# EasyEDA Pro project backup.epro, board PCB_Pre_1
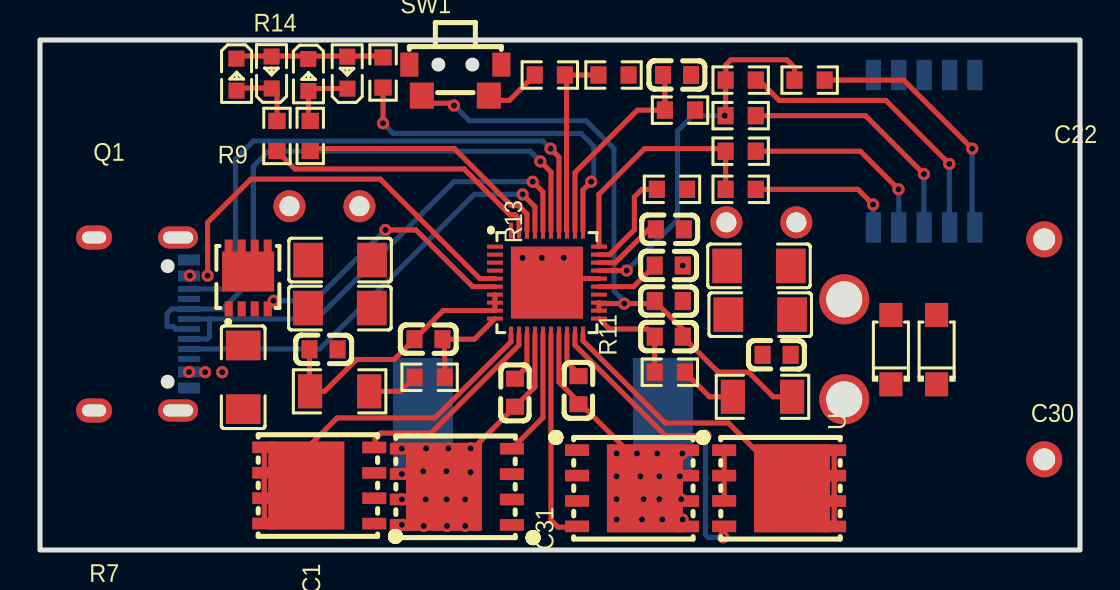
[diagram p6: board, top side]
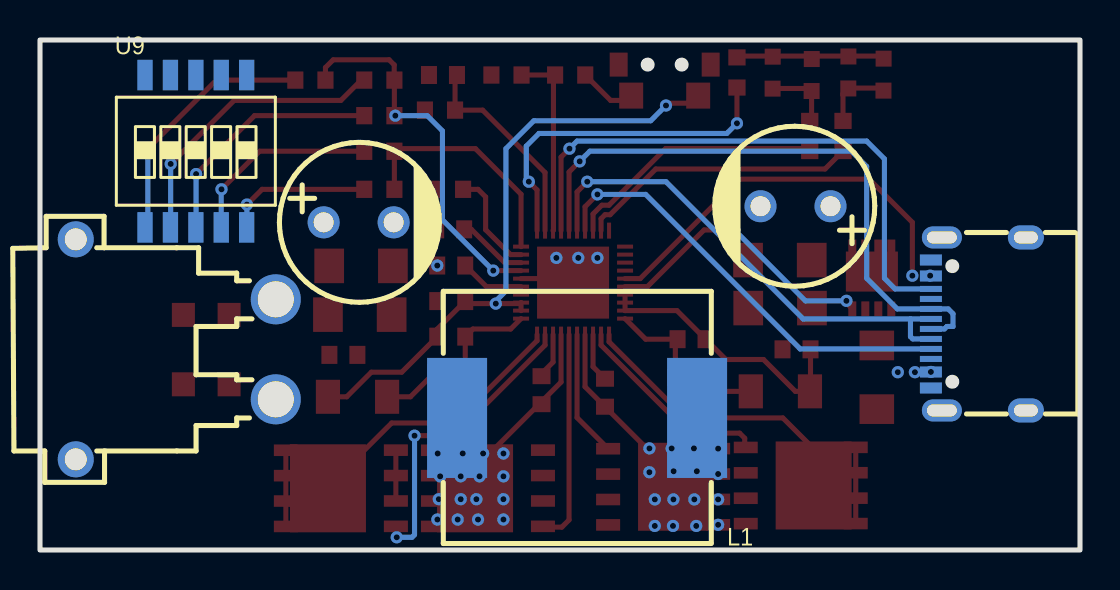
[diagram p7: board, bottom side, seen from below]

Outline 52 x 25.5 mm; copper layers: Top Layer, Inner1, Inner2, Bottom Layer. Coordinates in mm from the lower left corner of the outline.
Outline path: rectangle 0,25.5 52,0
Stack: Top Layer 0.035mm 外层铜厚1oz / Dielectric1 0.2104mm 7628 RC49% 8.6mil / Inner1 0.0152mm 内层铜厚 / Dielectric2 1.065mm 1.1mm H/HOZ 含铜 / Inner2 0.0152mm 内层铜厚 / Dielectric3 0.2104mm 7628 RC49% 8.6mil / Bottom Layer 0.035mm 外层铜厚1oz

## Design rules (mm)
template: 自定义配置
spacing copperThickness1oz (default): track to track 0.102, other pairs 0.152 to 0.3
spacing copperThickness2oz: track to track 0.203, other pairs 0.152 to 0.3
track width copperThickness1oz (default): min 0.127, default 0.254, max 2.54
track width copperThickness2oz: min 0.203, default 0.254, max 2.54
differential pair differentialPair (default): width min 0.127, default 0.254, max 2.54; gap min 0.152, default 0.152
via viaSize (default): diameter min 0.5, default 0.61, max 10; hole min 0.3, default 0.305, max 6.3

## Placement (name value [footprint] x y rotation side)
C1  100nF  [C0603]  23.75 7.86 90 top
C2  100nF  [C0603]  26.92 7.99 90 top
C7  22uF  [C1206]  15 12.1 180 top
C8  22uF  [C1206]  15.01 14.5 180 top
C10  100nF  [C0603]  14.17 10.03 180 top
C15  100nF  [C0603]  36.83 9.76 0 top
C17  22uF  [C1206]  36.01 11.77 0 top
C18  22uF  [C1206]  35.95 14.2 0 top
C20  2.2uF  [C0603]  31.44 14.22 0 top
C21  2.2uF  [C0603]  31.44 12.45 0 top
C22  100nF  [C0603]  31.85 23.75 0 top
C23  2.2uF  [C0603]  31.49 16.03 0 top
C29  470nF  [C0603]  19.42 10.54 0 top
C30  470nF  [C0603]  31.44 10.67 0 top
C31  22uF  [C1206]  10.16 8.64 270 top
C32  100uF/50V  [CAP-TH_BD8.0-P3.50-D0.6-FD]  14.22 17.19 0 bottom
C33  100uF/50V  [CAP-TH_BD8.0-P3.50-D0.6-FD]  36.07 16.38 180 bottom
CN1  XT30PW-M  [CONN-TH_XT30PW-M]  45.21 10.03 270 bottom
L1  22uH  [IND-SMD_L13.45-W12.6]  25.15 6.6 0 bottom
LED1  NCD0603R1  [LED0603-RD_RED]  9.82 23.77 270 top
LED2  NCD0603R1  [LED0603-RD_RED]  11.58 23.88 90 top
LED3  NCD0603R1  [LED0603-RD_RED]  13.42 23.75 270 top
LED4  NCD0603R1  [LED0603-RD_RED]  15.37 23.87 90 top
Q1  RU3030M2  [PDFN3333-8_L3.1-W3.2-P0.65-LS3.4-BL]  10.41 13.59 0 top
R7  51Ω  [R0603]  19.48 8.64 0 top
R8  5mΩ  [R1206]  14.98 7.93 0 top
R9  10Ω  [R0603]  31.49 8.89 180 top
R10  5mΩ  [R1206]  36.12 7.66 0 top
R11  100Ω  [R0603]  11.85 20.7 90 top
R12  100Ω  [R0603]  13.51 20.7 90 top
R13  100Ω  [R0603]  17.15 23.88 90 top
R14  10kΩ  [R0603]  32 21.99 0 top
R15  43kΩ  [R0603]  25.49 23.75 0 top
R16  10kΩ  [R0603]  28.68 23.75 180 top
R17  27kΩ  [R0603]  31.6 18.03 0 top
R18  3.6kΩ  [R0603]  35.03 18.03 0 top
R19  9.1kΩ  [R0603]  35.03 19.94 0 top
R20  27kΩ  [R0603]  35.03 21.72 0 top
R21  13kΩ  [R0603]  35.03 23.5 0 top
R22  9.1kΩ  [R0603]  38.48 23.5 0 top
SW1  TS24CA  [SW-SMD_TS24CA]  20.77 23.5 0 top
U1  -  [IP2366]  22.85 10.87 0 top
U2  AGM40P100A  [DFN-8_L5.8-W4.9-P1.27-LS6.0-BL-1]  13.96 3.23 90 top
U3  AGM40P100A  [DFN-8_L5.8-W4.9-P1.27-LS6.0-BL-1]  36.96 3.08 270 top
U4  AGM40P100A  [DFN-8_L5.8-W4.9-P1.27-LS6.0-BL-1]  20.84 3.16 90 top
U5  AGM40P100A  [DFN-8_L5.8-W4.9-P1.27-LS6.0-BL-1]  29.6 3.08 270 top
U7  SMF30A  [SOD-123FL_L2.7-W1.8-LS3.7-RD]  42.54 10.02 90 top
U8  SMF30A  [SOD-123FL_L2.7-W1.8-LS3.7-RD]  44.83 10.02 90 top
U9  DSHP05TSGER  [SW-SMD_10P-P1.27-L7.8-W5.4]  44.21 19.94 180 bottom
USB1  TYPE-C 16PIN 2MD(073)  [USB-C-SMD_TYPE-C-6PIN-2MD-073]  5.08 11.3 90 bottom

## Footprints (pads in the part's own frame, mm; a bottom-side part is the same pattern mirrored in y, then rotated)
C0603
  rect 0.8x0.9 smd: 1(-0.7,0) 2(0.7,0)
C1206
  rect 1.485x1.728 smd: 1(-1.593,0) 2(1.593,0)
CAP-TH_BD8.0-P3.50-D0.6-FD
  round 1.6 hole 1: 1(-1.75,0) 2(1.75,0)
CONN-TH_XT30PW-M
  round 2.5 hole 1.8: 1(-2.5,5) 2(2.5,5)
  round 1.8 hole 1.1: 3(5.5,-5) 4(-5.5,-5)
DFN-8_L5.8-W4.9-P1.27-LS6.0-BL-1
  rect 0.58x1.2 smd: 1(-1.907,-2.75) 2(-0.637,-2.75) 3(0.632,-2.75) 4(1.903,-2.75) 5(1.907,2.75) 6(0.637,2.75) 7(-0.632,2.75) 8(-1.903,2.75)
  rect 4.4x3.8 smd: 9(0,0.646)
IND-SMD_L13.45-W12.6
  rect 3x6 smd: 1(-6,0) 2(6,0)
IP2366
  rect 0.8x0.2 smd: 1(-0.1,4.3) 2(-0.1,3.9) 3(-0.1,3.5) 4(-0.1,3.1) 5(-0.1,2.7) 6(-0.1,2.3) 7(-0.1,1.9) 8(-0.1,1.5) 9(-0.1,1.1) 10(-0.1,0.7) 21(5.1,0.7) 22(5.1,1.1) 23(5.1,1.5) 24(5.1,1.9) 25(5.1,2.3) 26(5.1,2.7) 27(5.1,3.1) 28(5.1,3.5) 29(5.1,3.9) 30(5.1,4.3)
  rect 0.2x0.8 smd: 11(0.7,-0.1) 12(1.1,-0.1) 13(1.5,-0.1) 14(1.9,-0.1) 15(2.3,-0.1) 16(2.7,-0.1) 17(3.1,-0.1) 18(3.5,-0.1) 19(3.9,-0.1) 20(4.3,-0.1) 31(4.3,5.1) 32(3.9,5.1) 33(3.5,5.1) 34(3.1,5.1) 35(2.7,5.1) 36(2.3,5.1) 37(1.9,5.1) 38(1.5,5.1) 39(1.1,5.1) 40(0.7,5.1)
  rect 3.6x3.6 smd: 41(2.5,2.5)
LED0603-RD_RED
  rect 0.8x0.8 smd: 1(-0.799,-0.004) 2(0.799,0.004)
PDFN3333-8_L3.1-W3.2-P0.65-LS3.4-BL
  rect 0.4x0.75 smd: 1(-0.975,-1.534) 2(-0.325,-1.534) 3(0.325,-1.534) 4(0.975,-1.534)
  rect 0.4x0.8 smd: 5(0.975,1.534) 6(0.325,1.534) 7(-0.325,1.534) 8(-0.975,1.534)
  rect 2.6x2 smd: 9(-0.004,0.333)
R0603
  rect 0.806x0.864 smd: 1(-0.753,0) 2(0.753,0)
R1206
  rect 1.208x1.701 smd: 1(-1.479,0) 2(1.479,0)
SOD-123FL_L2.7-W1.8-LS3.7-RD
  rect 1.2x1.15 smd: 1(-1.735,0) 2(1.735,0)
SW-SMD_10P-P1.27-L7.8-W5.4
  rect 0.762x1.524 smd: 1(-2.54,-3.81) 2(-1.27,-3.81) 3(0,-3.81) 4(1.27,-3.81) 5(2.54,-3.81) 6(2.54,3.81) 7(1.27,3.81) 8(0,3.81) 9(-1.27,3.81) 10(-2.54,3.81)
SW-SMD_TS24CA
  rect 0.9x1.2 smd: 1(-2.3,0.775) 2(2.3,0.775)
  rect 1.2x1.3 smd: 3(-1.675,-0.775) 4(1.675,-0.775)
USB-C-SMD_TYPE-C-6PIN-2MD-073
  rect 0.55x1.1 smd: 1(-3.2,2.375) 2(-2.4,2.375) 11(2.4,2.375) 12(3.2,2.375)
  rect 0.3x1.1 smd: 3(-1.75,2.375) 4(-1.25,2.375) 5(-0.75,2.375) 6(-0.25,2.375) 7(0.25,2.375) 8(0.75,2.375) 9(1.25,2.375) 10(1.75,2.375)
  oval 1.2x1.8 hole 0.6x1.2: 13(-4.325,-2.375) 14(4.325,-2.375)
  oval 1.1x2 hole 0.6x1.5: 13(-4.325,1.825) 14(4.325,1.825)

## Nets
As in the schematic.

Pads without a net: U1 1 2 3 4 24 40; USB1 3 9

## Via types
v1: diameter 0.61, hole 0.305, Top Layer to Bottom Layer, 60 vias

## Routing (per net, layer and track width the routed paths; a pad name or vN(x,y) marks a point on that pad's centre or on a via; arc(x,y) is an arc through that point)
GND: length 2.7
  Top Layer w0.254: U1.26 25.55,13.57 U1.41
  vias: v1(24.13,14.61) v1(25.09,14.61) v1(26.18,14.61) v1(32.14,14.22)
VBUS: length 20
  Top Layer w0.254: U1.5 21.99,13.57 17.02,18.54 10.54,18.54 8.38,16.38 v1(8.38,13.72)
  vias: v1(7.49,13.72) v1(7.45,8.9) v1(8.25,8.89) v1(9.11,8.89)
$C1_1: length 9.5
  Top Layer w0.254: U4.9 20.2,3.61 C1.1 24.75,8.16 U1.14
  vias: v1(18.09,5.07) v1(18.09,3.8) v1(18.09,2.53) v1(18.09,1.26) v1(19.16,3.94) v1(19.19,1.2) v1(19.3,5.08) v1(19.28,2.53) v1(20.32,3.94) v1(20.33,2.53) v1(20.42,5.08) v1(20.35,1.2) v1(21.26,2.53) v1(21.26,1.2) v1(21.53,5.08) v1(21.53,3.89)
$C1_2: length 2.5
  Top Layer w0.254: U1.13 24.35,9.16 C1.2
$C2_1: length 12
  Top Layer w0.254: U3.3 U3.2 U3.1 ; U5.9 30.25,4.09 25.95,8.39 U1.17
  vias: v1(28.83,4.83) v1(28.83,3.68) v1(28.83,2.54) v1(28.83,1.52) v1(29.84,4.83) v1(30.02,3.68) v1(30.1,1.52) v1(30.18,2.54) v1(30.86,4.83) v1(30.96,3.68) v1(30.96,2.54) v1(31.12,1.52) v1(31.99,3.68) v1(32.12,4.83) v1(32.06,2.54) v1(32.13,1.52)
$C2_2: length 2
  Top Layer w0.254: U1.18 26.35,9.39 26.8,8.94
$C7_2: length 13.8
  Top Layer w0.254: U1.7 U1.8 U1.9 20.15,11.97 C29.1 17.71,9.53 15.83,9.53 14.23,7.93 R8.1 13.47,7.96 C10.2
$C20_1: length 3.2
  Top Layer w0.254: U1.25 29.68,13.17 30.74,14.22
$C23_1: length 3.5
  Top Layer w0.254: C23.1 30.43,16.03 28.77,14.37 U1.28
$C29_2: length 5
  Top Layer w0.254: R7.2 20.23,10.43 C29.2 21.72,10.54 U1.10
$C30_1: length 4.9
  Top Layer w0.254: U1.21 28.47,11.05 30.36,11.05 30.74,10.67 30.74,8.89 R9.2
$LED1_1: length 7.4
  Top Layer w0.254: R13.2 17.09,24.7 9.82,24.7
$LED1_2: length 3.5
  Top Layer w0.254: R11.2 11.85,22.81 LED2.1 11.57,23.1 9.83,23.1
$LED3_2: length 3.6
  Top Layer w0.254: LED4.1 15.36,23.08 13.42,23.08 13.42,21.55 R12.2
$Q1_4: length 14.2
  Top Layer w0.254: U1.6 21.63,13.17 18.8,16 v1(17.27,16) ; v1(11.68,12.46) 11.68,12.35 Q1.4
  Bottom Layer w0.254: v1(11.68,12.46) 13.73,12.46 v1(17.27,16)
$R7_1: length 2.6
  Top Layer w0.254: R8.2 18.02,7.93 R7.1
$R9_1: length 2.9
  Top Layer w0.254: R9.1 33.48,7.66 34.65,7.66
$R15_1: length 2.6
  Top Layer w0.254: 22.71,22.48 23.47,22.48 R15.1
$R17_1: length 5.2
  Top Layer w0.254: R17.1 30.1,18.03 29.72,17.65 29.72,16.01 28.47,14.77 U1.29
$R18_2: length 7.3
  Top Layer w0.254: R18.2 40.89,18.03 v1(41.66,17.27)
  Bottom Layer w0.254: v1(41.66,17.27) 41.66,16.14 U9.5
$R19_2: length 9.8
  Top Layer w0.254: v1(42.93,18.03) 41.02,19.94 R19.2
  Bottom Layer w0.254: v1(42.93,18.03) 42.94,18.02 U9.4
$R20_2: length 12.3
  Top Layer w0.254: v1(44.2,18.8) 41.28,21.72 R20.2
  Bottom Layer w0.254: v1(44.2,18.8) 44.2,16.14 U9.3
$R21_2: length 14.6
  Top Layer w0.254: R21.2 35.94,23.5 36.96,22.48 42.29,22.48 v1(45.47,19.3)
  Bottom Layer w0.254: U9.2 45.47,16.14 v1(45.47,19.3)
$R22_2: length 12.8
  Top Layer w0.254: v1(46.61,20.07) 43.18,23.5 R22.2
  Bottom Layer w0.254: v1(46.61,20.07) 46.61,16.27 U9.1
$U1_11: length 18.5
  Top Layer w0.254: U1.11 23.55,10.41 19.74,6.6 14.86,6.6 13.32,5.06 U2.9 ; U2.5 U2.6 U2.8
$U1_20: length 17.7
  Top Layer w0.254: U3.5 U3.6 U3.7 U3.8 ; 37.6,3.08 37.6,3.16 34.42,6.35 31.27,6.35 27.15,10.47 U1.20
BAT: length 30.7
  Top Layer w0.254: R10.2 36.66,7.66 35.43,8.89 33.91,8.89 C30.2 32.14,11.05 30.74,12.45 30.61,12.32 v1(29.21,12.32) 28,12.32 U1.23 U1.22 ; v1(20.7,22.22) 20.59,22.34 19.22,22.34
  Bottom Layer w0.254: v1(29.21,12.32) 29.21,12.45 28.7,12.95 28.7,20.07 27.31,21.46 21.46,21.46 v1(20.7,22.22)
BATC: length 11.9
  Top Layer w0.254: U1.30 27.95,17.79 30.23,20.07 34.15,20.07 R19.1 R18.1
BATNU: length 19
  Top Layer w0.254: v1(34.23,21.72) 34.28,21.76 R21.1 34.29,23.5 34.29,24.26 34.54,24.51 37.34,24.51 37.73,24.12 R22.1 ; v1(29.34,13.97) 27.95,13.97
  Bottom Layer w0.254: v1(34.23,21.72) 32.64,21.72 31.88,20.95 31.88,16.51 v1(29.34,13.97)
CC1: length 21.9
  Top Layer w0.254: U1.37 24.75,17.16 v1(24.13,17.78)
  Bottom Layer w0.254: USB1.4 13.99,10.05 21.72,17.78 v1(24.13,17.78)
CC2: length 29.1
  Top Layer w0.254: U1.34 25.95,19.65 v1(25.53,20.07)
  Bottom Layer w0.254: USB1.10 9.24,13.05 9.78,13.59 9.78,19.56 10.67,20.45 25.15,20.45 v1(25.53,20.07)
DM: length 24.6
  Top Layer w0.254: v1(24.64,18.42) 25.15,17.91 U1.36
  Bottom Layer w0.254: v1(24.64,18.42) 20.7,18.42 13.84,11.55 8.48,11.55 ; USB1.7 8.48,11.55 ; 8.48,11.55 8.48,10.67 8.36,10.55 USB1.5
DP: length 31
  Top Layer w0.254: U1.35 25.55,18.9 v1(25.02,19.43)
  Bottom Layer w0.254: v1(25.02,19.43) 24.51,19.94 11.43,19.94 10.67,19.18 10.67,13.59 9.13,12.05 USB1.8 6.59,12.05 6.35,11.81 6.35,11.18 6.66,11.18 6.78,11.05 USB1.6
EN: length 9.3
  Top Layer w0.254: R15.2 26.33,23.75 26.33,15.99 U1.33 ; 26.67,23.75 28.05,23.75
HG1: length 10.1
  Top Layer w0.254: U1.12 23.95,10.24 19.55,5.84 17.02,5.84 16.76,5.59 16.76,5.18 U2.4
HG2: length 15.4
  Top Layer w0.254: U1.19 26.75,10.24 31.27,5.72 v1(33.27,5.72) ; v1(34.16,0.64) 34.21,0.68 U3.4
  Bottom Layer w0.254: v1(33.27,5.72) 33.27,0.76 33.4,0.64 v1(34.16,0.64)
LED1: length 14.1
  Top Layer w0.254: R11.1 12.75,19.05 21.21,19.05 23.5,16.76 23.75,16.76 23.95,16.57 U1.39
LED2: length 12.9
  Top Layer w0.254: U1.38 24.35,16.8 23.91,17.24 23.55,17.24 20.71,20.07 13.62,20.07
LED3: length 17.5
  Top Layer w0.254: v1(27.56,18.42) 27.15,18 U1.31 ; 17.15,23.38 v1(17.15,21.34)
  Bottom Layer w0.254: v1(27.56,18.42) 27.69,18.54 27.69,20.19 27.05,20.83 17.66,20.83 v1(17.15,21.34)
LG1: length 6.3
  Top Layer w0.254: U1.15 25.15,6.62 U4.4
LG2: length 10.7
  Top Layer w0.254: U5.4 26.81,1.14 25.91,1.14 25.55,1.5 U1.16
NTC: length 10.5
  Top Layer w0.254: U1.32 26.75,18.87 29.87,21.99 R14.1 31.25,23.65 C22.1

## Copper pours and planes (outline as drawn; the poured copper is in the pictures)
GND on Top Layer: -7.37,32.89 59.18,32.89 59.18,-6.35 -7.37,-6.35
GND on Bottom Layer: -19.56,42.93 66.29,42.93 66.29,-13.08 -19.56,-13.08
GND on Inner1: 0.26,25.24 51.74,25.24 51.74,0.26 0.26,0.26
GND on Inner2: 0.26,25.24 51.74,25.24 51.74,0.26 0.26,0.26
VBUS on Top Layer: 6.86,13.4 8.06,13.4 8.13,13.33 8.13,10.07 8.14,10.05 8.14,9.29 8.13,9.27 6.78,9.27 6.78,8.59 6.86,8.51 11.56,8.51 11.68,8.62 11.68,12.7 8.89,12.7 8.76,12.83 8.76,13.84 8.51,14.1 6.86,14.1
$C1_1 on Top Layer: 17.49,4.29 17.4,4.19 16.05,4.19 16.05,0.76 22.1,0.76 22.22,0.89 22.22,5.38 17.49,5.38
$C1_1 on Bottom Layer: 17.65,9.65 22.23,9.65 22.23,0.62 17.65,0.62
$C2_1 on Top Layer: 28.66,5.28 34.8,5.28 34.8,2.16 33.01,2.16 33.01,0.34 28.26,0.34 28.26,5.28 28.66,5.28
$C2_1 on Bottom Layer: 28.32,9.65 32.65,9.65 32.65,0.55 28.32,0.55
$C7_2 on Top Layer: 11.75,17.91 14.22,17.91 14.22,9.4 14.1,9.27 12.56,9.27 12.56,12.73 12.44,12.84 9.28,12.84 9.07,13.05 9.07,15.22
BAT on Top Layer: 36.63,6.75 36.8,6.58 41.3,6.58 41.32,6.6 45.85,6.6 45.85,9.02 45.72,9.14 38.99,9.14 38.86,9.27 38.86,17.37 36.63,17.37

Small or netless copper shapes (teardrops, artwork), in the pictures only: 36 on Inner1, 36 on Inner2
